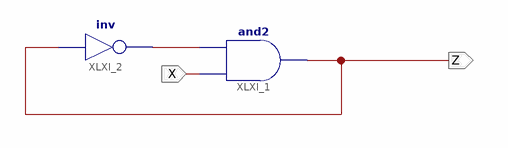
[diagram p0: schematic sheet 1]
// Xilinx ISE schematic sch.sch (spartan3e) as structural Verilog: 2 symbols, 2 ports
module sch (
  input  X,
  output Z
);

  wire XLXN_2;

  and XLXI_1 (Z, X, XLXN_2);
  not XLXI_2 (XLXN_2, Z);
endmodule
